# Altium schematic sheet WiFI Switch.v2.SchDoc: WiFi Switch - Main Board
size A4; Date: 8.11.2017; DrawnBy: Miroslav Batek; DocumentNumber: WiFi Switch; Revision: 2; SheetNumber: 1; SheetTotal: 1; PageSetup: Record=PageOptions|CenterHorizontal=True|CenterVertical=True|PrintScale=1.00|XCorrection=1.00|YCorrection=1.00|PrintKind=0|BorderSize=5000000|LeftOffset=0|BottomOffset=0|Orientation=2|PaperLength=1000|PaperWidth=1000|Scale=100|PaperSource=15|PrintQuality=600|MediaType=1|DitherType=10|PaperKind=A4|PrintScaleMode=1
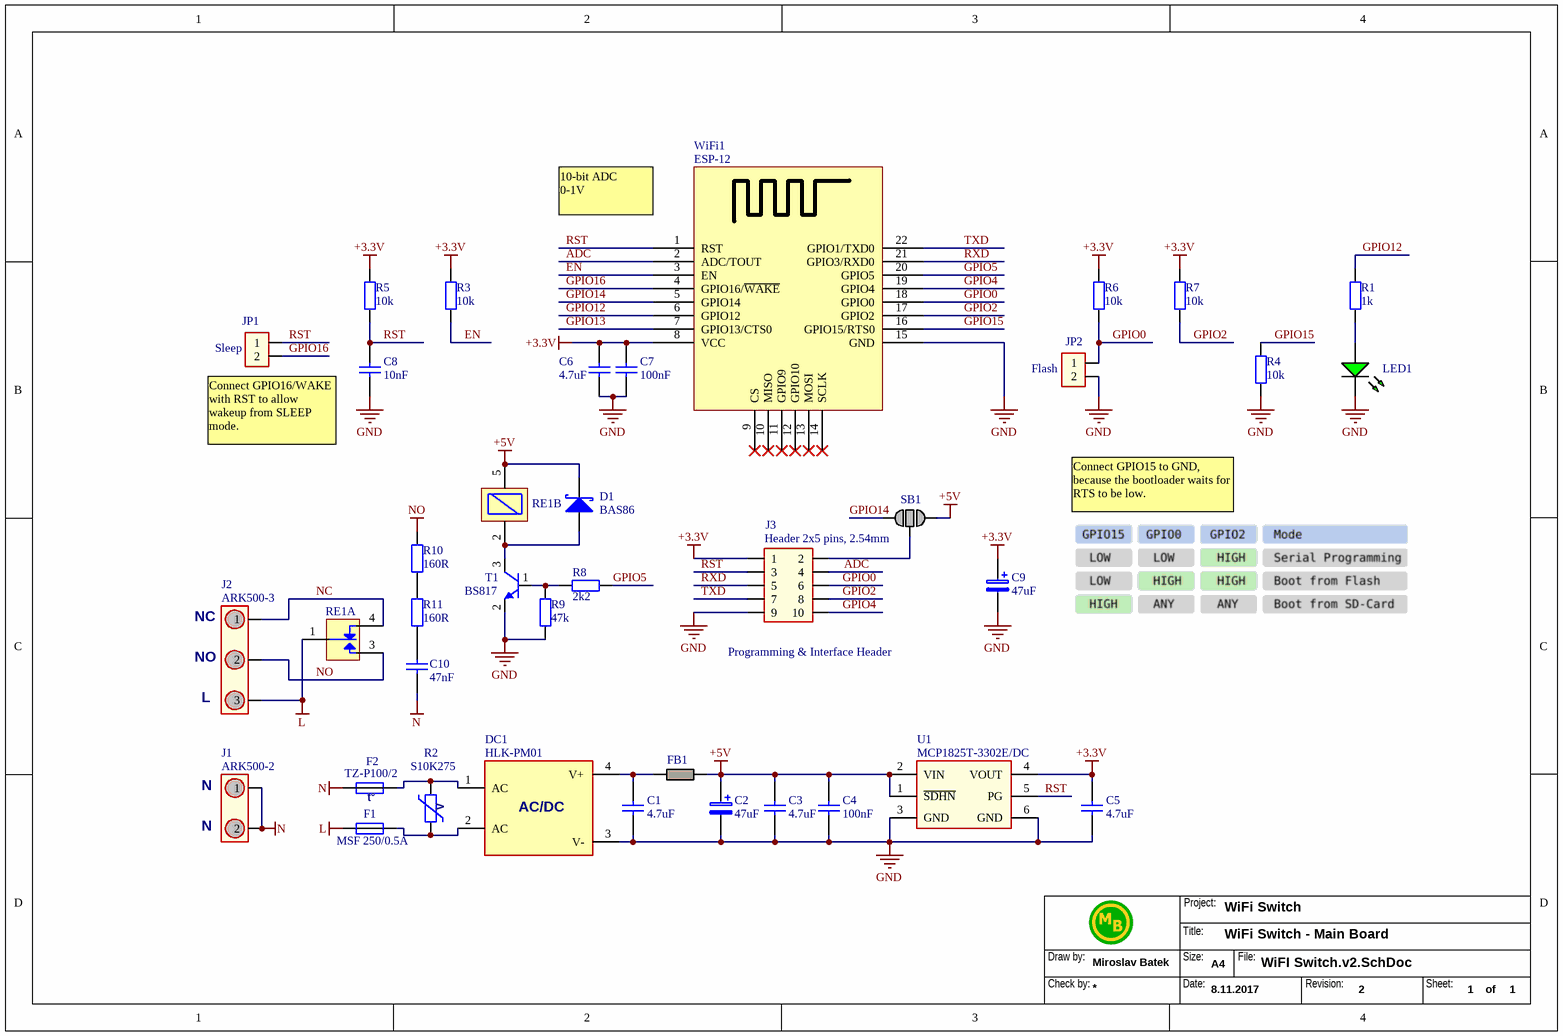
[diagram p0: WiFI Switch.v2.SchDoc]

## Parts
C1  value 4.7uF  [SMD_C_0805_HAND]  (hidden comment: CAPACITOR)
C2  value 47uF  [TRH_CPOL_D6_3_RM2_5]  (hidden comment: CAPACITOR_POLARIZED)
C3  value 4.7uF  [SMD_C_0805_HAND]  (hidden comment: CAPACITOR)
C4  value 100nF  [SMD_C_0805_HAND]  (hidden comment: CAPACITOR)
C5  value 4.7uF  [SMD_C_0805_HAND]  (hidden comment: CAPACITOR)
C6  value 4.7uF  [SMD_C_0805_HAND]  (hidden comment: CAPACITOR)
C7  value 100nF  [SMD_C_0805_HAND]  (hidden comment: CAPACITOR)
C8  value 10nF  [SMD_C_0805_HAND]  (hidden comment: CAPACITOR)
C9  value 47uF  [TRH_CPOL_D6_3_RM2_5]  (hidden comment: CAPACITOR_POLARIZED)
C10  value 47nF  [TRH_C_17.5x5_RM15]  (hidden comment: CAPACITOR)
D1  Manufacturer Part Number: BAS86  [SMD_SOD80C]  (hidden comment: glass cylinder)
DC1  HLK-PM01
F1  value MSF 250/0.5A  [TRH_MSF250]  (hidden comment: Fuse)
F2  value TZ-P100/2  [TRH_TZ-Pxxx_2A]  (hidden comment: FUSE_TEMP)
FB1  Ferrite  [SMD_R_0805_HAND]  (value not drawn)
J1  value ARK500-2  [TRH_ARK500-2]  (hidden comment: TERMINAL2)
J2  value ARK500-3  [TRH_ARK500-3]  (hidden comment: TERMINAL3)
J3  Part Number: Header 2x5 pins, 2.54mm  [TRH_HDR2X05]  (hidden comment: JUMPER5x2)
JP1  JUMPER2  [TRH_HDR1X02]  (value not drawn)
JP2  JUMPER2  [TRH_HDR1X02]  (value not drawn)
LED1  LED_GREEN  [SMD_LED_0805_HAND]  (value not drawn)
R1  value 1k  [SMD_R_0805_HAND]  (hidden comment: 1k0, 0.1W, 1%, SMD 0805)
R2  value S10K275  [TRH_S10K275]  (hidden comment: VARISTOR)
R3  value 10k  [SMD_R_0805_HAND]  (hidden comment: 10k, 0.1W, 1%, SMD 0805)
R4  value 10k  [SMD_R_0805_HAND]  (hidden comment: 10k, 0.1W, 1%, SMD 0805)
R5  value 10k  [SMD_R_0805_HAND]  (hidden comment: 10k, 0.1W, 1%, SMD 0805)
R6  value 10k  [SMD_R_0805_HAND]  (hidden comment: 10k, 0.1W, 1%, SMD 0805)
R7  value 10k  [SMD_R_0805_HAND]  (hidden comment: 10k, 0.1W, 1%, SMD 0805)
R8  value 2k2  [SMD_R_0805_HAND]  (hidden comment: 2k2, 0.1W, 1%, SMD 0805)
R9  value 47k  [SMD_R_0805_HAND]  (hidden comment: 47k, 0.1W, 1%, SMD 0805)
R10  value 160R  [SMD_R_1206_HAND]  (hidden comment: 160R, 0.25W, 1%, SMD 1206)
R11  value 160R  [SMD_R_1206_HAND]  (hidden comment: 160R, 0.25W, 1%, SMD 1206)
RE1  SRD-xxVDC-SL-C  [TRH_SRD-xxVDC-SL-C]  (value not drawn)  (parts A,B of 2)
SB1  Solder Switch  [SOLDER_BRIDGE_SWITCH_SMALL]  (value not drawn)
T1  value BS817  [SMD_SOT23-3]
U1  value MCP1825T-3302E/DC  [SMD_SOT223-5_HAND]  (hidden comment: MCP1825T-xxxxE-DC)
WiFi1  ESP-12  [SMD_ESP-12]

## Nets
+3.3V: C5.2 C6.2 C7.2 C9.1 J3.1 R3.2 R5.2 R6.2 R7.2 U1.4(VOUT) WiFi1.8(VCC)
+5V: C2.1 C3.2 C4.2 D1.2(K) FB1.2 RE1.5(COIL2) SB1.3 U1.1(~{SDHN}) U1.2(VIN)
GND: C1.1 C2.2 C3.1 C4.1 C5.1 C6.1 C7.1 C8.1 C9.2 DC1.3(V-) J3.9 JP2.2 LED1.2(K) R4.2 R9.1 T1.2(E) U1.3(GND) U1.6(GND) WiFi1.15(GND)
L: F1.1 J2.3 RE1.1(COMMON1)
N: C10.1 F2.1 J1.1 J1.2
NO: J2.2 R10.1 RE1.3(NO)
ADC: J3.4 WiFi1.2(ADC/TOUT)
EN: R3.1 WiFi1.3(EN)
GPIO0: J3.6 JP2.1 R6.1 WiFi1.18(GPIO0)
GPIO2: J3.8 R7.1 WiFi1.17(GPIO2)
GPIO4: J3.10 WiFi1.19(GPIO4)
GPIO5: R8.2 WiFi1.20(GPIO5)
GPIO12: R1.2 WiFi1.6(GPIO12)
GPIO13: WiFi1.7(GPIO13/CTS0)
GPIO14: SB1.1 WiFi1.5(GPIO14)
GPIO15: R4.1 WiFi1.16(GPIO15/RTS0)
GPIO16: JP1.2 WiFi1.4(GPIO16/~{WAKE})
NC: J2.1 RE1.4(NC)
RST: C8.2 J3.3 JP1.1 R5.1 U1.5(PG) WiFi1.1(RST)
RXD: J3.5 WiFi1.21(GPIO3/RXD0)
TXD: J3.7 WiFi1.22(GPIO1/TXD0)
NetC1_2: C1.2 DC1.4(V+) FB1.1
NetC10_2: C10.2 R11.2
NetD1_1: D1.1(A) RE1.2(COIL1) T1.3(C)
NetDC1_1: DC1.1(AC) F2.2 R2.2
NetDC1_2: DC1.2(AC) F1.2 R2.1
NetJ3_2: J3.2 SB1.2
NetLED1_1: LED1.1(A) R1.1
NetR8_1: R8.1 R9.2 T1.1(B)
NetR10_2: R10.2 R11.1

Not connected (* = marked no-connect by the designer): WiFi1 9(CS)* 10(MISO)* 11(GPIO9)* 12(GPIO10)* 13(MOSI)* 14(SCLK)*

## Notes on the sheet
- (near WiFi1) 10-bit ADC
  0-1V
- (near JP1) Sleep
- (near JP2) Flash
- Connect GPIO16/WAKE with RST to allow wakeup from SLEEP mode.
- Connect GPIO15 to GND, because the bootloader waits for RTS to be low.
- (near J2) NC
- (near J3) Programming & Interface Header
- (near J2) NO
- (near J2) L
- (near J1) N
- Project:
- Draw by:
- Check by:
- Title:
- Size:
- Date:
- A4
- File:
- Revision:
- Sheet:
- of
- (in symbol HLK-PM01) AC/DC
- (in symbol S10K275) V
- (in symbol TZ-P100/2) t°

## Library data of the parts
C1 C3 C5 C6 = CAP CER 0805 4.7uF 16V X7R 10%: Manufacturer: TDK; Manufacturer Part Number: C2012X7R1C475K125AB; Description: Capacitor 4.7uF 0805; Validated: N; Part Number: CAP CER 0805 4.7uF 16V X7R 10%; ComponentLink1URL: http://product.tdk.com/capacitor/mlcc/en/documents/mlcc_commercial_general_en.pdf; Supplier 1: Farnell; Supplier Code 1: 2346939; Latest Revision Date: 6-Feb-2014; Publisher: JM
C2 C9 = CAP POL 47uF 16V 105C 20%: Polarized Capacitor; Description: Capacitor 47uF, 16V, 6.3x5, polarised; Part Number: CAP POL 47uF 16V 105C 20%; Supplier 2: GME; Supplier Code 2: 123-373; Latest Revision Date: 26.øíj.16; Publisher: MB
C4 C7 = CAP CER 0805 100nF 50V X7R 10%: Manufacturer: MULTICOMP; Manufacturer Part Number: MC0805B104K500CT; Description: Capacitor 100nF 0805; Validated: N; Part Number: CAP CER 0805 100nF 50V X7R 10%; ComponentLink1URL: http://www.farnell.com/datasheets/1792107.pdf; Supplier 1: Farnell; Supplier Code 1: 1759265; Latest Revision Date: 6-Feb-2014; Publisher: JM
C8 = CAP CER 0805 10nF 50V X7R 10%: Manufacturer: MULTICOMP; Manufacturer Part Number: MC0805B103K500CT; Description: Capacitor 10nF 0805; Validated: N; Part Number: CAP CER 0805 10nF 50V X7R 10%; ComponentLink1URL: http://www.farnell.com/datasheets/1792107.pdf; Supplier 1: Farnell; Supplier Code 1: 1759246; Latest Revision Date: 6-Feb-2014; Publisher: JM
C10 = CFAC047N: Description: Capacitor 47nF, X2, 275V AC; Part Number: CFAC047N; Supplier 2: GME; Supplier Code 2: 121-275; Latest Revision Date: 26.øíj.16; Publisher: MB
D1 = BAS86 SOD-80 0.2A 50V Shottky: Shottky diode; Manufacturer: NXP; Value: 0.2A; Description: DIODE, SCHOTTKY, 0.2A, 50V; Part Number: BAS86 SOD-80 0.2A 50V Shottky; ComponentLink1Description: Datasheet; ComponentLink1URL: http://www.farnell.com/datasheets/1751005.pdf; Supplier 1: Farnell; Supplier Code 1: 8734542; Latest Revision Date: 13-Feb-2014; Publisher: JM
F1 = MSF 250/0.5A: Part Number: MSF 250/0.5A; Description: MSF 250/0.5A; Supplier 2: GME; Supplier Code 2: 633-184; Latest Revision Date: 26-Oct-16
F2 = TZ-P100/2: Temperature Fuse; Description: Temperature Fuse 100C/2A; Part Number: TZ-P100/2; Supplier 1: TME; Supplier Code 1: TZ-P100/2; Latest Revision Date: 8.1.2017; Publisher: MB
FB1 = 2508056017Y2: Manufacturer: FAIR-RITE; Value: 0.1ODC, 600O/100MHz, 2A; Description: Ferite Bead 0805; Validated: No; Latest Revision Note: Added; Part Number: 2508056017Y2; ComponentLink1Description: Web Page; ComponentLink1URL: http://cz.farnell.com/fair-rite/25080560172/ferrite-bead-0-1ohm-2a-0805/dp/1838838?Ntt=1838838; ComponentLink2Description: Datasheet; ComponentLink2URL: http://www.farnell.com/datasheets/652149.pdf; Manufacturer Part Number: 2508056017Y2; Supplier 1: Farnell; Supplier Code 1: 1838838; Latest Revision Date: 3/15/2014; Publisher: MB
J1 = ARK500-2: Description: Terminal 2 (5mm); Part Number: ARK500-2; Supplier 2: GME; Supplier Code 2: 821-048; Latest Revision Date: 26-Oct-16; Publisher: MB
J2 = ARK500-3: Description: Terminal 3 (5mm); Part Number: ARK500-3; Supplier 2: GME; Supplier Code 2: 821-008; Latest Revision Date: 26.øíj.16; Publisher: MB
J3 = Header 2x5 pins, 2.54mm: Manufacturer: HARWIN; Manufacturer Part Number: M20-9970546; Validated: No; Latest Revision Note: Added; ComponentLink1Description: Web Page; ComponentLink1URL: http://cz.farnell.com/harwin/m20-9970546/header-extended-2row-5way/dp/1022227; ComponentLink2Description: Datasheet; ComponentLink2URL: file:///z:\MEMS Application Group\Altium\Altium_Libraries\Datasheets\Connectors\header-6130xx21121.pdf; Supplier 1: Farnell; Supplier Code 1: 1022227; Supplier 2: GME; Supplier Code 2: 832-092 (40 pins); Latest Revision Date: 20.2.2014; Publisher: ID
JP1 JP2 = Header 1x2 pins, 2.54mm: Manufacturer: HARWIN; Manufacturer Part Number: M20-9990246; Validated: No; Latest Revision Note: Added; Part Number: Header 1x2 pins, 2.54mm; ComponentLink1Description: Web Page; ComponentLink1URL: http://cz.farnell.com/harwin/m20-9990246/header-straight-2-54mm-1row-2way/dp/1022247; ComponentLink2Description: Datasheet; ComponentLink2URL: file:///z:\MEMS Application Group\Altium\Altium_Libraries\Datasheets\Connectors\header-6130xx11121.pdf; Supplier 1: Farnell; Supplier Code 1: 1022247; Supplier 2: GME; Supplier Code 2: 832-021 (40 pins); Latest Revision Date: 20.2.2014; Publisher: ID
LED1 = LED GREEN 0805 450mcd 120°: LED; Manufacturer: OPTOSUPPLY; Manufacturer Part Number: OSTG0805C1A_N; Value: 450mcd; Description: LED Green 0805, 2.40V@0.1mA; Part Number: LED GREEN 0805 450mcd 120°; ComponentLink1Description: Datasheet; ComponentLink1URL: http://www.gme.cz/img/cache/doc/960/346/ostg0805c1a-n-datasheet-1.pdf; Supplier 1: GME; Supplier Code 1: 960346; Latest Revision Date: 11.9.2014; Publisher: RS
R1 = RES 0805 1k0 1% 1/10W: Resistor; Manufacturer: MULTICOMP; Manufacturer Part Number: MC01W080511K; Validated: No; Latest Revision Note: Added to database; Part Number: RES 0805 1k0 1% 1/10W; Simulation Model Name: RESISTOR; ComponentLink1Description: Web page; ComponentLink1URL: http://cz.farnell.com/multicomp/mc01w080511k/resistor-1k-0-1w-1-0805-reel/dp/2129113; ComponentLink2Description: Datasheet; ComponentLink2URL: file:///z:\MEMS Application Group\Altium\Altium_Libraries\Datasheets\Passives\ThickFilmChipResistor_0805.pdf; Supplier 1: Farnell; Supplier Code 1: 2129113; Supplier 2: GME; Supplier Code 2: 901-178; Latest Revision Date: 10.2.2014; Publisher: ID
R2 = S10K275: Part Number: S10K275; Description: Varistor; Supplier 2: GME; Supplier Code 2: 115-568; Latest Revision Date: 26-Oct-16; Publisher: MB
R3-R7 = RES 0805 10k 1% 1/10W: Resistor; Manufacturer: MULTICOMP; Manufacturer Part Number: MC01W0805110K; Validated: No; Latest Revision Note: Added to database; Part Number: RES 0805 10k 1% 1/10W; Simulation Model Name: RESISTOR; ComponentLink1Description: Web page; ComponentLink1URL: http://cz.farnell.com/multicomp/mc01w0805110k/resistor-10k-0-1w-1-0805-reel/dp/2129195; ComponentLink2Description: Datasheet; ComponentLink2URL: file:///z:\MEMS Application Group\Altium\Altium_Libraries\Datasheets\Passives\ThickFilmChipResistor_0805.pdf; Supplier 1: Farnell; Supplier Code 1: 2129195; Supplier 2: GME; Supplier Code 2: 901-176; Latest Revision Date: 10.2.2014; Publisher: ID
R8 = RES 0805 2k2 1% 1/10W: Resistor; Manufacturer: MULTICOMP; Manufacturer Part Number: MC01W080512K2; Validated: No; Latest Revision Note: Added to database; Part Number: RES 0805 2k2 1% 1/10W; Simulation Model Name: RESISTOR; ComponentLink1Description: Web page; ComponentLink1URL: http://cz.farnell.com/multicomp/mc01w080512k2/resistor-2k2-0-1w-1-0805-reel/dp/2129138; ComponentLink2Description: Datasheet; ComponentLink2URL: file:///z:\MEMS Application Group\Altium\Altium_Libraries\Datasheets\Passives\ThickFilmChipResistor_0805.pdf; Supplier 1: Farnell; Supplier Code 1: 2129138; Supplier 2: GME; Supplier Code 2: 901-210; Latest Revision Date: 10.2.2014; Publisher: ID
R9 = RES 0805 47k 1% 1/10W: Resistor; Manufacturer: MULTICOMP; Manufacturer Part Number: MC01W0805147K; Validated: No; Latest Revision Note: Added to database; Part Number: RES 0805 47k 1% 1/10W; Simulation Model Name: RESISTOR; ComponentLink1Description: Web page; ComponentLink1URL: http://cz.farnell.com/multicomp/mc01w0805147k/resistor-47k-0-1w-1-0805-reel/dp/2129250; ComponentLink2Description: Datasheet; ComponentLink2URL: file:///z:\MEMS Application Group\Altium\Altium_Libraries\Datasheets\Passives\ThickFilmChipResistor_0805.pdf; Supplier 1: Farnell; Supplier Code 1: 2129250; Supplier 2: GME; Supplier Code 2: 901-195; Latest Revision Date: 10.2.2014; Publisher: ID
R10 R11 = RES 1206 160R 1% 0.25W: Resistor; Validated: No; Latest Revision Note: Added to database; Part Number: RES 1206 160R 1% 0.25W; Simulation Model Name: RESISTOR; Supplier 2: GME; Supplier Code 2: 900-501; Latest Revision Date: 5.11.2016; Publisher: MB
RE1 = SRD-5VDC-SL-C: Description: Rele 5V 250V/10A (ebay); Part Number: SRD-5VDC-SL-C; Value: SRD-5VDC-SL-C; Supplier 1: Fanrell; Supplier Code 1: 1094018; Supplier 2: GME; Supplier Code 2: 634-246; Latest Revision Date: 26.øíj.16; Publisher: MB
SB1 = Solder Bridge Switch Small: Validated: No; Latest Revision Note: Added; Part Number: Solder Bridge Switch Small; Value: Solder Switch; Supplier 1: -; Supplier Code 1: -; Latest Revision Date: 23.4.2014; Publisher: MB
T1 = BC817 NPN 45V 0.5A: NPN General-purpose Transistor; Manufacturer: NXP; Manufacturer Part Number: BC817; Description: Transistor NPN SOT23-3; Part Number: BC817 NPN 45V 0.5A; ComponentLink1Description: Web page; ComponentLink1URL: http://cz.farnell.com/nxp/bc817/transistor-npn-45v-sot-23/dp/1081223?Ntt=1081223; ComponentLink2Description: Datasheet; ComponentLink2URL: http://www.nxp.com/documents/data_sheet/BC817_BC817W_BC337.pdf; Supplier 1: Farnell; Supplier Code 1: 1081223; Latest Revision Date: 20-Feb-2014; Publisher: JM
U1 = MCP1825T-3302E/DC: LDO; Description: LDO 3.3V/500mA; Part Number: MCP1825T-3302E/DC; Supplier 1: Farnell; Supplier Code 1: 1578410; Latest Revision Date: 26.øíj.16; Publisher: MB
WiFi1 = ESP-12: ESP8266 Wifi Module; Description: ESP8266 Module (ESP-12); Part Number: ESP-12; Value: ESP-12; Supplier 2: AliExpress; Supplier Code 2: ???; Latest Revision Date: 25.øíj.16; Publisher: MB